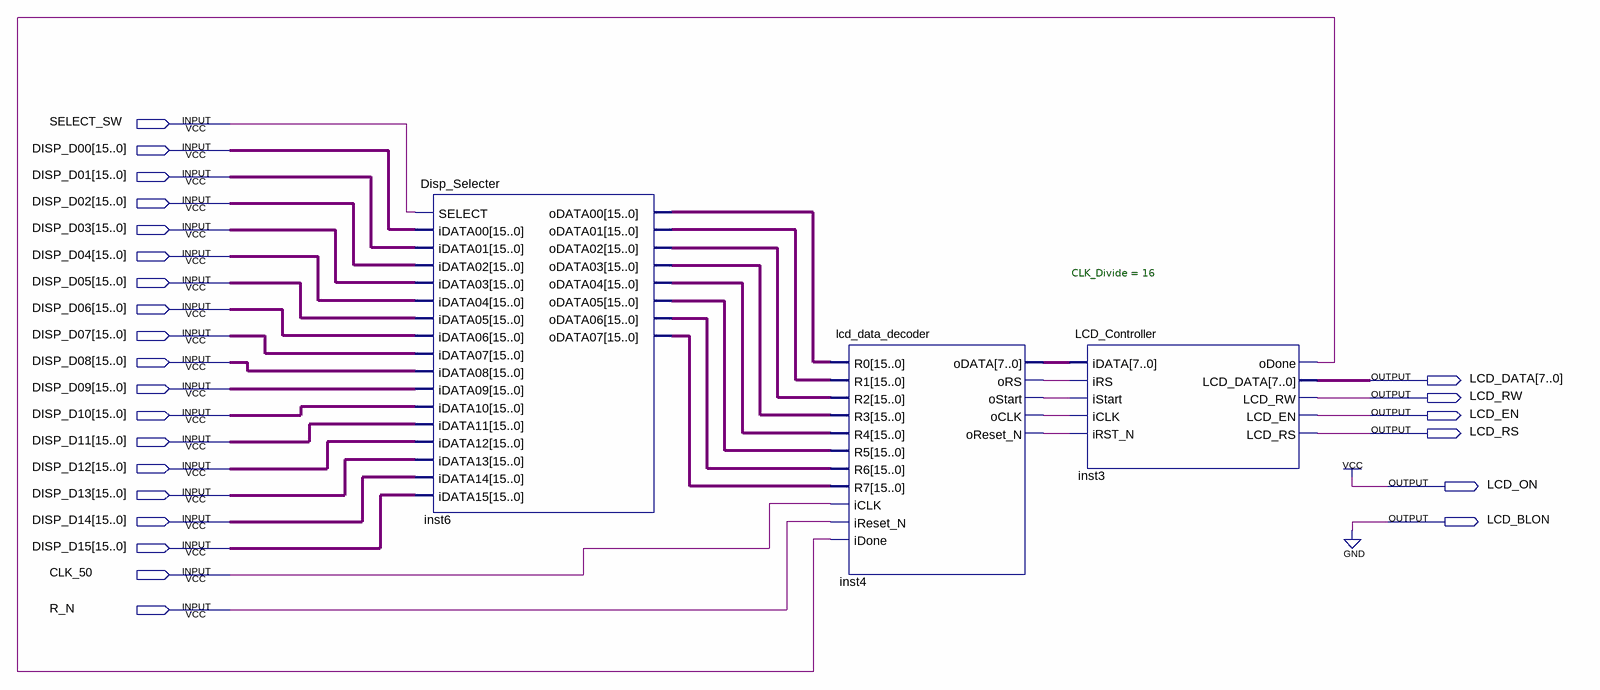
[diagram p0: schematic sheet]
// Quartus schematic lcd_display_16data.bdf as structural Verilog: 3 symbols, 25 pins
module lcd_display_16data (
  input  SELECT_SW,
  input  [15:0] DISP_D00,
  input  [15:0] DISP_D01,
  input  [15:0] DISP_D02,
  input  [15:0] DISP_D03,
  input  [15:0] DISP_D04,
  input  [15:0] DISP_D05,
  input  [15:0] DISP_D06,
  input  [15:0] DISP_D07,
  input  [15:0] DISP_D08,
  input  [15:0] DISP_D09,
  input  [15:0] DISP_D10,
  input  [15:0] DISP_D11,
  input  [15:0] DISP_D12,
  input  [15:0] DISP_D13,
  input  [15:0] DISP_D14,
  input  [15:0] DISP_D15,
  input  CLK_50,
  input  R_N,
  output [7:0] LCD_DATA,
  output LCD_RW,
  output LCD_EN,
  output LCD_RS,
  output LCD_ON,
  output LCD_BLON
);

  wire inst3_odone, inst4_oclk, inst4_oreset_n, inst4_ors, inst4_ostart;
  wire [7:0] inst4_odata;
  wire [15:0] inst6_odata00, inst6_odata01, inst6_odata02, inst6_odata03, inst6_odata04, inst6_odata05,
       inst6_odata06, inst6_odata07;

  Disp_Selecter inst6 (
    .SELECT(SELECT_SW), .iDATA00(DISP_D00), .iDATA01(DISP_D01), .iDATA02(DISP_D02), .iDATA03(DISP_D03),
    .iDATA04(DISP_D04), .iDATA05(DISP_D05), .iDATA06(DISP_D06), .iDATA07(DISP_D07), .iDATA08(DISP_D08),
    .iDATA09(DISP_D09), .iDATA10(DISP_D10), .iDATA11(DISP_D11), .iDATA12(DISP_D12), .iDATA13(DISP_D13),
    .iDATA14(DISP_D14), .iDATA15(DISP_D15), .oDATA00(inst6_odata00), .oDATA01(inst6_odata01),
    .oDATA02(inst6_odata02), .oDATA03(inst6_odata03), .oDATA04(inst6_odata04), .oDATA05(inst6_odata05),
    .oDATA06(inst6_odata06), .oDATA07(inst6_odata07));
  lcd_data_decoder inst4 (
    .R0(inst6_odata00), .R1(inst6_odata01), .R2(inst6_odata02), .R3(inst6_odata03), .R4(inst6_odata04),
    .R5(inst6_odata05), .R6(inst6_odata06), .R7(inst6_odata07), .iCLK(CLK_50), .iReset_N(R_N),
    .iDone(inst3_odone), .oDATA(inst4_odata), .oRS(inst4_ors), .oStart(inst4_ostart), .oCLK(inst4_oclk),
    .oReset_N(inst4_oreset_n));
  LCD_Controller #(.CLK_Divide(16)) inst3 (
    .iDATA(inst4_odata), .iRS(inst4_ors), .iStart(inst4_ostart), .iCLK(inst4_oclk), .iRST_N(inst4_oreset_n),
    .oDone(inst3_odone), .LCD_DATA(LCD_DATA), .LCD_RW(LCD_RW), .LCD_EN(LCD_EN), .LCD_RS(LCD_RS));

  assign LCD_BLON = 1'b0;
  assign LCD_ON = 1'b1;
endmodule
